# EAGLE design xadow-3-Axis Digital Accelerometer(б└400g) (EAGLE 6.4)

## Sheet 1 of 2
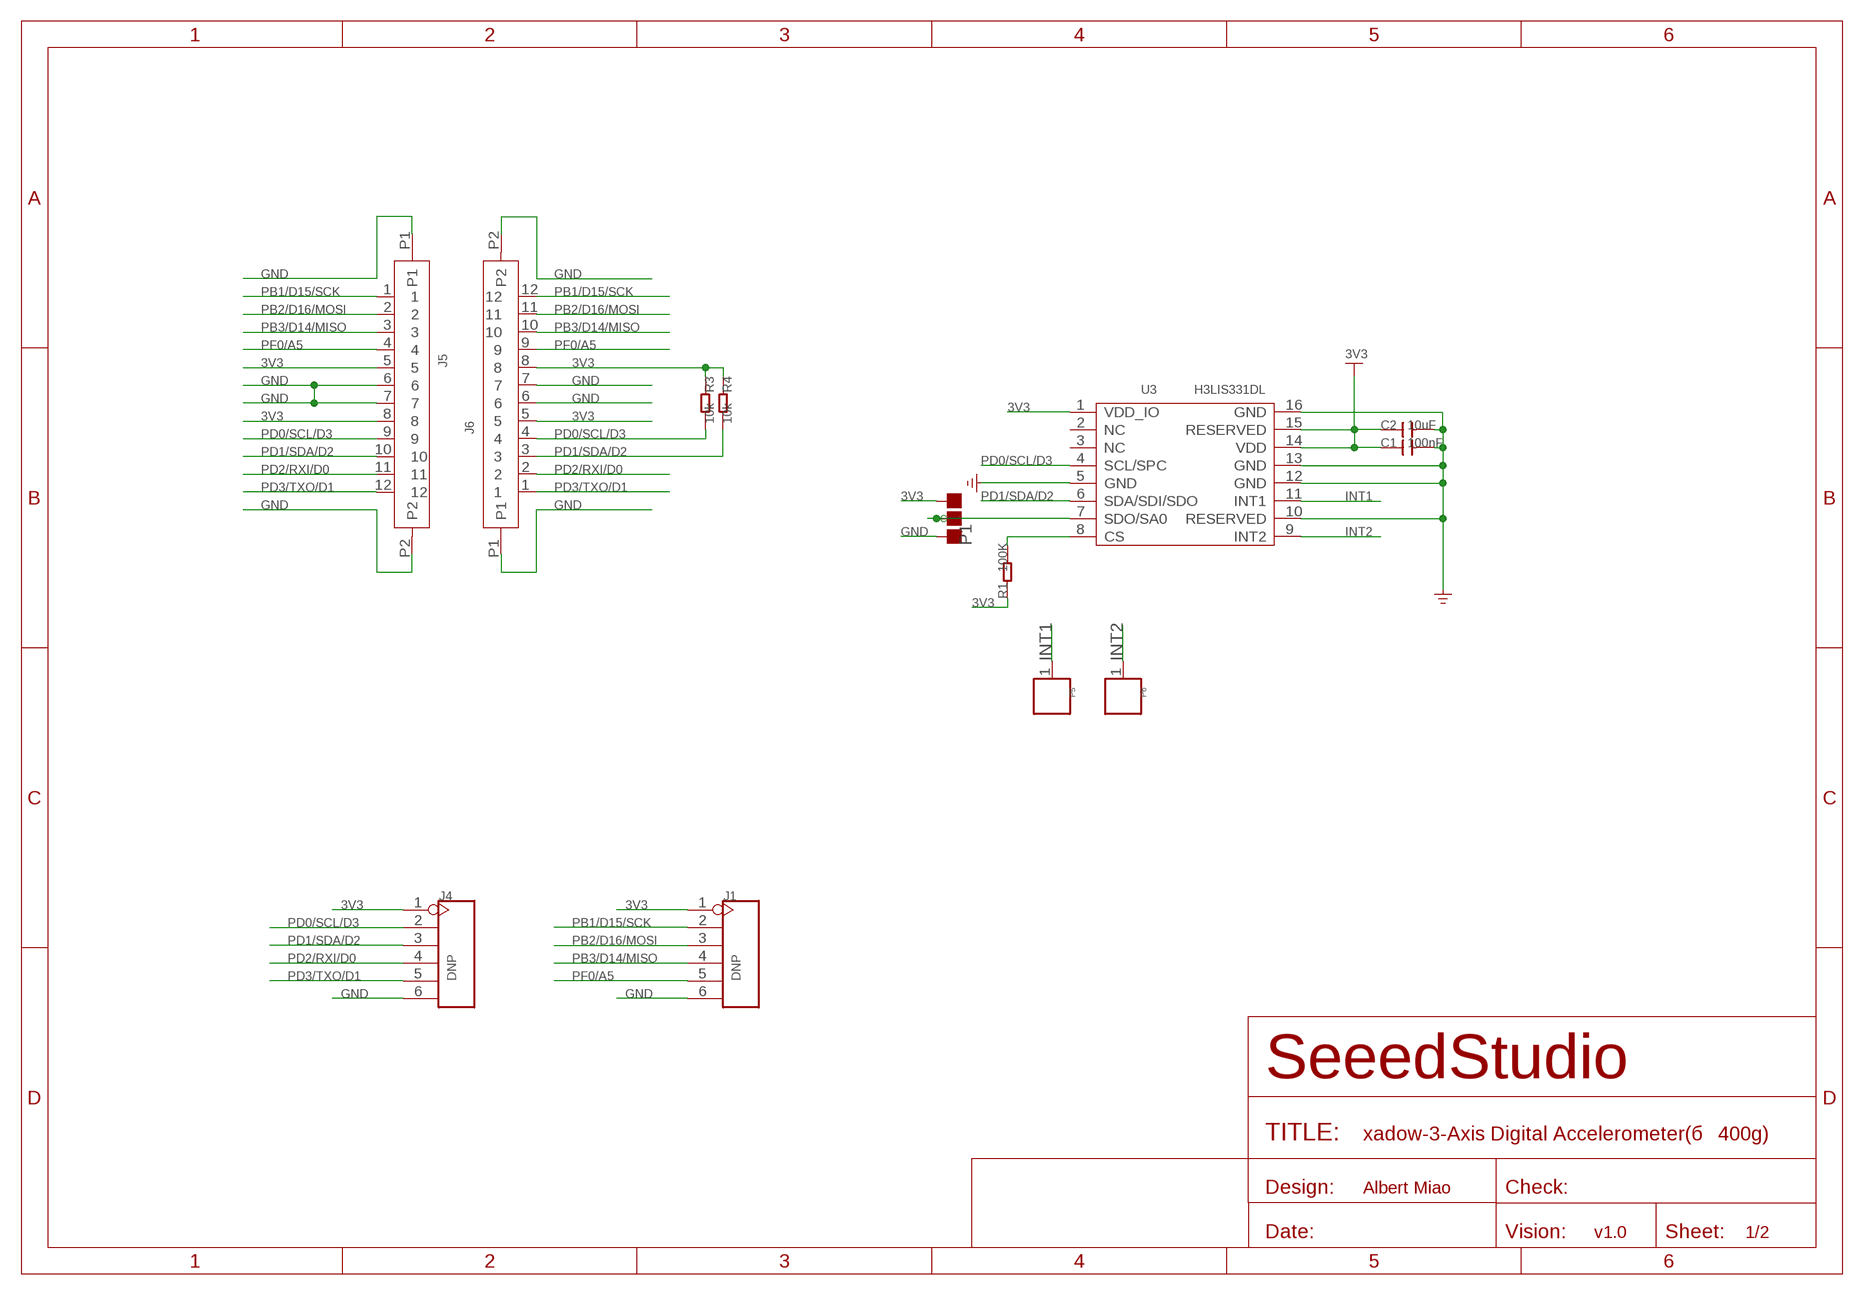
[diagram p0: schematic, sheet 1]

### Parts
C1  100nF  C-0603  [C0603]
C2  10uF  C-0805  [C0805]
J1  DNP  HEADER-6P-65/35MIL  [6P-2.54-65/35MIL]
J4  DNP  HEADER-6P-65/35MIL  [6P-2.54-65/35MIL]
J5  FPC052002-12LT-FH12-12S-0.5SH  [12P-0.5-NEW]
J6  FPC052002-12LT-FH12-12S-0.5SH  [12P-0.5-NEW]
P1  PAD-JUMPER-3P-40*40  [3P-SMD-4.1X1.5]
P5  PAD'60/30'  [1P-65/35MIL]
P6  PAD'60/30'  [1P-65/35MIL]
R1  100K  R-0603  [R0603]
R3  10k  R-0603  [R0603]
R4  10k  R-0603  [R0603]
U3  H3LIS331DL  H3LIS331DL  [TFLGA-16]

### Nets
3V3: C1.1 C2.1 J1.1 J4.1 J5.5 J5.8 J6.5 J6.8 P1.00(L) R1.1 R3.1 R4.1 U3.1(VDD_IO) U3.14(VDD) U3.15(RESERVED) ; supply symbol labelled POWER_BAR
GND: C1.2 C2.2 J1.6 J4.6 J5.6 J5.7 J5.P1 J5.P2 J6.6 J6.7 J6.P1 J6.P2 P1.11(R) U3.5(GND) U3.10(RESERVED) U3.12(GND) U3.13(GND) U3.16(GND)
INT1: P5.1 U3.11(INT1)
INT2: P6.1 U3.9(INT2)
N$1: R1.2 U3.8(CS)
N$3: P1.MM(C) U3.7(SDO/SA0)
PB1/D15/SCK: J1.2 J5.1 J6.12
PB2/D16/MOSI: J1.3 J5.2 J6.11
PB3/D14/MISO: J1.4 J5.3 J6.10
PD0/SCL/D3: J4.2 J5.9 J6.4 R3.2 U3.4(SCL/SPC)
PD1/SDA/D2: J4.3 J5.10 J6.3 R4.2 U3.6(SDA/SDI/SDO)
PD2/RXI/D0: J4.4 J5.11 J6.2
PD3/TXO/D1: J4.5 J5.12 J6.1
PF0/A5: J1.5 J5.4 J6.9
Unconnected: U3.2(NC) U3.3(NC)

### Notes on the sheet
- Albert Miao
- v1.0

## Sheet 2 of 2
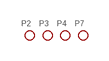
[diagram p1: schematic, sheet 2]

### Parts
P2  PAD-MARK  [ROUND-MARK-1.0]
P3  PAD-MARK  [ROUND-MARK-1.0]
P4  PAD-MARK  [ROUND-MARK-1.0]
P7  PAD-MARK  [ROUND-MARK-1.0]

## Library data of the parts
C1 C2 = Discrete:C*: Ceramic Capacitors
J1 J4 = Connector:HEADER-6P
J5 J6 = template :FPC052002-12LT
P1 = Discrete:PAD-JUMPER-3P; PARTNO: DNP
P2-P4 P7 = Discrete:PAD-MARK; PARTNO: DNP
P5 P6 = Discrete:PAD
R1 R3 R4 = Discrete:R*
U3 = template :H3LIS331DL: MEMS motion sensor with digital output, low power, high-g, 3-axis accelerometer

## Net classes
0 default: width 0.152 mm, drill 0.305 mm, clearance 0.152 mm
1 GND: width 0.152 mm, drill 0.305 mm, clearance 0.152 mm to class 0, clearance 0.152 mm

## Board
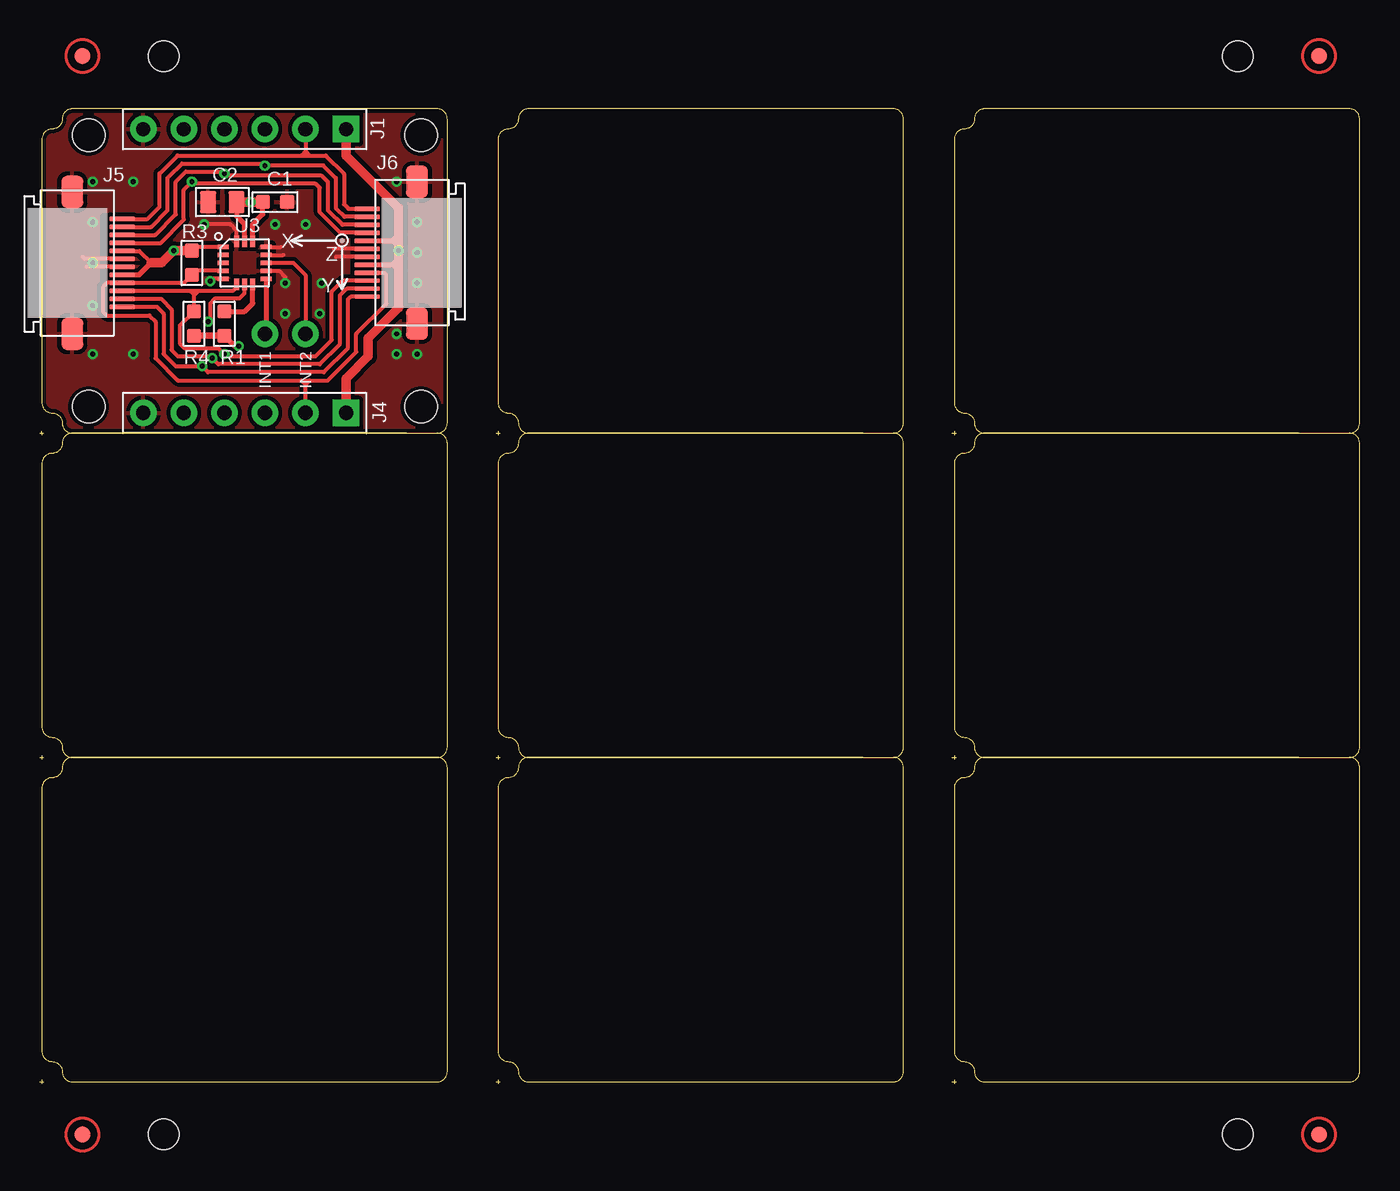
[diagram p2: board, top side]
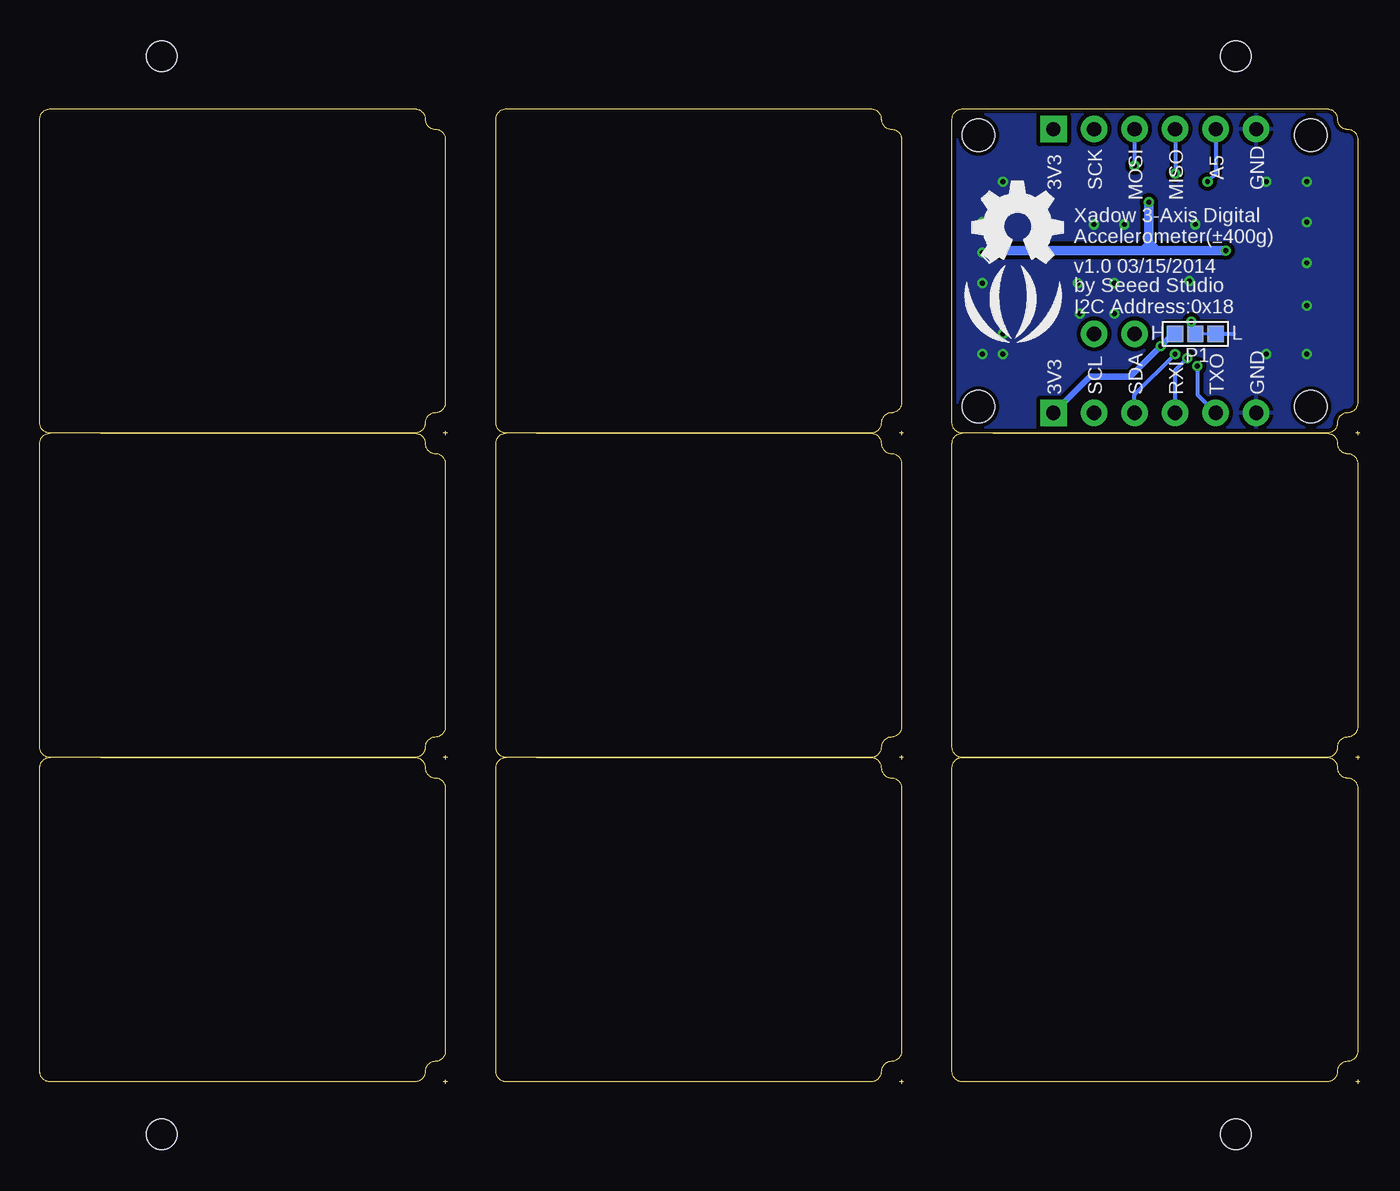
[diagram p3: board, bottom side, seen from below]

Size 82.68 x 61.09 mm. Coordinates in mm from the lower left corner, seen from the top.
Outline: 25.53,60.45 arc90 24.89,61.09
Outline: 2.03,61.09 arc90 1.4,60.45
Outline: 1.4,60.45 arc-90 0.76,59.82
Outline: 0.76,59.82 arc90 0.13,59.18
Outline: 0.13,42.67 arc90 0.76,42.04
Outline: 0.76,42.04 arc-90 1.4,41.4
Outline: 1.4,41.4 arc90 2.03,40.77
Outline: 24.89,40.77 arc90 25.53,41.4
Outline: 25.53,60.45 arc90 24.89,61.09
Outline: 24.89,61.09 2.03,61.09
Outline: 2.03,61.09 arc90 1.4,60.45
Outline: 1.4,60.45 arc-90 0.76,59.82
Outline: 0.76,59.82 arc90 0.13,59.18
Outline: 0.13,42.67 arc90 0.76,42.04
Outline: 0.76,42.04 arc-90 1.4,41.4
Outline: 1.4,41.4 arc90 2.03,40.77
Outline: 2.03,40.77 22.99,40.77
Outline: 22.99,40.77 24.89,40.77
Outline: 24.89,40.77 arc90 25.53,41.4
Outline: 0.13,40.77 0.25,40.77
Outline: 0.13,40.77 0.13,40.89
Outline: 25.53,41.4 25.53,60.45
Outline: 25.53,60.45 arc90 24.89,61.09
Outline: 2.03,61.09 arc90 1.4,60.45
Outline: 1.4,60.45 arc-90 0.76,59.82
Outline: 0.76,59.82 arc90 0.13,59.18
Outline: 0.13,59.18 0.13,42.67
Outline: 0.13,42.67 arc90 0.76,42.04
Outline: 0.76,42.04 arc-90 1.4,41.4
Outline: 1.4,41.4 1.4,41.4
Outline: 1.4,41.4 arc90 2.03,40.77
Outline: 2.03,40.77 24.89,40.77
Outline: 24.89,40.77 arc90 25.53,41.4
Outline: 0,40.77 0.13,40.77
Outline: 0.13,40.77 0.13,40.64
Outline: 82.04,20.45 arc-90 82.68,19.81 82.68,0.76 arc-90 82.04,0.13 78.87,0.13 59.18,0.13 arc-90 58.55,0.76
Outline: 78.87,20.45 59.18,20.45
Outline: 59.18,20.45 arc90 58.55,19.81 arc-90 57.91,19.18 arc90 57.28,18.54 57.28,2.03 arc90 57.91,1.4 arc-90 58.55,0.76
Outline: 58.55,0.76 58.55,0.76
Outline: 57.15,0.13 57.4,0.13
Outline: 57.28,0.25 57.28,0
Outline: 24.89,20.45 arc-90 25.53,19.81 25.53,0.76 arc-90 24.89,0.13 2.03,0.13 arc-90 1.4,0.76
Outline: 24.89,20.45 2.03,20.45
Outline: 2.03,20.45 arc90 1.4,19.81 arc-90 0.76,19.18 arc90 0.13,18.54 0.13,2.03 arc90 0.76,1.4 arc-90 1.4,0.76
Outline: 1.4,0.76 1.4,0.76
Outline: 0,0.13 0.25,0.13
Outline: 0.13,0.25 0.13,0
Outline: 53.47,20.45 arc-90 54.1,19.81 54.1,0.76 arc-90 53.47,0.13 51.56,0.13 30.61,0.13 arc-90 29.97,0.76
Outline: 51.56,20.45 30.61,20.45
Outline: 30.61,20.45 arc90 29.97,19.81 arc-90 29.34,19.18 arc90 28.7,18.54 28.7,2.03 arc90 29.34,1.4 arc-90 29.97,0.76
Outline: 29.97,0.76 29.97,0.76
Outline: 28.57,0.13 28.83,0.13
Outline: 28.7,0.25 28.7,0
Outline: 58.55,41.4 arc90 57.91,42.04 arc-90 57.28,42.67 57.28,59.18 arc-90 57.91,59.82 arc90 58.55,60.45 arc-90 59.18,61.09 82.04,61.09 arc-90 82.68,60.45 82.68,41.4 arc-90 82.04,40.77
Outline: 58.55,41.4 58.55,41.4
Outline: 58.55,41.4 arc90 59.18,40.77
Outline: 59.18,40.77 78.87,40.77
Outline: 78.87,40.77 82.04,40.77
Outline: 57.15,40.77 57.4,40.77
Outline: 57.28,40.89 57.28,40.64
Outline: 29.97,41.4 arc90 29.34,42.04 arc-90 28.7,42.67 28.7,59.18 arc-90 29.34,59.82 arc90 29.97,60.45 arc-90 30.61,61.09 53.47,61.09 arc-90 54.1,60.45 54.1,41.4 arc-90 53.47,40.77
Outline: 29.97,41.4 29.97,41.4
Outline: 29.97,41.4 arc90 30.61,40.77
Outline: 30.61,40.77 51.56,40.77
Outline: 51.56,40.77 53.47,40.77
Outline: 28.57,40.77 28.83,40.77
Outline: 28.7,40.89 28.7,40.64
Outline: 82.04,40.77 arc-90 82.68,40.13 82.68,21.08 arc-90 82.04,20.45
Outline: 78.87,40.77 59.18,40.77
Outline: 59.18,40.77 arc90 58.55,40.13 arc-90 57.91,39.5 arc90 57.28,38.86 57.28,22.35 arc90 57.91,21.72 arc-90 58.55,21.08
Outline: 58.55,21.08 58.55,21.08
Outline: 58.55,21.08 arc90 59.18,20.45
Outline: 59.18,20.45 78.87,20.45
Outline: 78.87,20.45 82.04,20.45
Outline: 57.15,20.45 57.4,20.45
Outline: 57.28,20.57 57.28,20.32
Outline: 24.89,40.77 arc-90 25.53,40.13 25.53,21.08 arc-90 24.89,20.45
Outline: 22.99,40.77 2.03,40.77
Outline: 2.03,40.77 arc90 1.4,40.13 arc-90 0.76,39.5 arc90 0.13,38.86 0.13,22.35 arc90 0.76,21.72 arc-90 1.4,21.08
Outline: 1.4,21.08 1.4,21.08
Outline: 1.4,21.08 arc90 2.03,20.45
Outline: 2.03,20.45 24.89,20.45
Outline: 0,20.45 0.25,20.45
Outline: 0.13,20.57 0.13,20.32
Outline: 53.47,40.77 arc-90 54.1,40.13 54.1,21.08 arc-90 53.47,20.45
Outline: 51.56,40.77 30.61,40.77
Outline: 30.61,40.77 arc90 29.97,40.13 arc-90 29.34,39.5 arc90 28.7,38.86 28.7,22.35 arc90 29.34,21.72 arc-90 29.97,21.08
Outline: 29.97,21.08 29.97,21.08
Outline: 29.97,21.08 arc90 30.61,20.45
Outline: 30.61,20.45 51.56,20.45
Outline: 51.56,20.45 53.47,20.45
Outline: 28.57,20.45 28.83,20.45
Outline: 28.7,20.57 28.7,20.32
Copper layers (1*16): Top 0.035mm / dielectric 1.5mm / Bottom 0.035mm
Design rules "SeeedStudio_rule_no_angle_090911 *": minimum track width 6mil, minimum drill 12mil, track to track 6mil, track to pad 6mil, pad to pad 6mil, via to via 6mil, smd to smd 0mil, copper to edge 10mil, drill to drill 10mil, minimum pad ring 10mil, minimum via ring 6mil, stop-mask expansion 2mil, vias tented up to drill 100mil, thermal gap 10mil
Holes 2.03 mm at 3.05,42.42 3.05,59.44 23.88,59.44 23.88,42.42
Holes 1.91 mm at 75.06,64.39 7.75,64.39 7.75,-3.17 75.06,-3.17
tRestrict: area 4.6,50.9 to 5.2,51; area 20.4,50.9 to 21,51; area 11.2,50 to 12.1,50.2; area 14,52.1 to 14.5,52.2; 21 lines
bRestrict: 21 lines

### Footprints (pad centres in the part's own frame; a part is rotated, then mirrored left to right if it is on the bottom)
C0603 = smd 0.889 x 0.889: 1 -0.762,0; 2 0.762,0
C0805 = smd 1.016 x 1.397: 1 -0.889,0; 2 0.889,0
6P-2.54-65/35MIL = drill 0.889 pad 1.651 square: 1 0,6.35 | drill 0.889 pad 1.651: 2 0,3.81; 3 0,1.27; 4 0,-1.27; 5 0,-3.81; 6 0,-6.35
12P-0.5-NEW = smd 0.3 x 1.6: 1 -2.75,3.127; 2 -2.25,3.127; 3 -1.75,3.127; 4 -1.25,3.127; 5 -0.75,3.127; 6 -0.25,3.127; 7 0.25,3.127; 8 0.75,3.127; 9 1.25,3.127; 10 1.75,3.127; 11 2.25,3.127; 12 2.75,3.127 | smd 2.032 x 1.397: P1 -4.445,0; P2 4.445,0
3P-SMD-4.1X1.5 = smd 1.016 x 1.016: 00 -1.27,0; 11 1.27,0; MM 0,0
ROUND-MARK-1.0 = smd 1.016 x 1.016: P$1 0,0
1P-65/35MIL = drill 0.889 pad 1.651: 1 0,0
R0603 = smd 0.889 x 0.889: 1 -0.762,0; 2 0.762,0
TFLGA-16 = smd 0.7 x 0.3: 1 -1.35,1; 2 -1.35,0.5; 3 -1.35,0; 4 -1.35,-0.5; 5 -1.35,-1; 9 1.35,-1; 10 1.35,-0.5; 11 1.35,0; 12 1.35,0.5; 13 1.35,1 | smd 0.3 x 0.7: 6 -0.5,-1.35; 7 0,-1.35; 8 0.5,-1.35; 14 0.5,1.35; 15 0,1.35; 16 -0.5,1.35

### Placement (x,y rotation side)
C1  14.73,55.25 0 top
C2  11.43,55.25 180 top
J1  12.83,59.82 270 top
J4  12.83,42.04 270 top
J5  2.03,51.44 270 top
J6  23.62,52.07 90 top
P1  10.29,46.99 0 bottom
P2  2.67,-3.17 0 top  (outside the outline)
P3  80.14,-3.17 0 top  (outside the outline)
P4  80.14,64.39 0 top  (outside the outline)
P5  16.64,46.99 0 top
P6  14.1,46.99 0 top
P7  2.67,64.39 0 top  (outside the outline)
R1  11.56,47.62 90 top
R3  9.53,51.44 270 top
R4  9.65,47.62 90 top
U3  12.83,51.44 0 top
U$2  [LOGO_SILK]  21.72,48.13 0 bottom
U$3  [OSHW_FILLX200_NOTEXT]  24.26,51.44 0 bottom

### Tracks (layer width: path | path; a pad name or v marks a point on that pad's centre or on a via)
3V3  (via drill 0.3 pad 0.64)
  Top 0.254: J5.5 6.24,52.19 6.99,51.44 | U3.1 9.76,52.44 R3.1
  Top 0.305: U3.15 12.83,53.85 12.32,54.36 C2.1 | U3.14 13.33,53.84 13.97,54.48 C1.1 | J5.8 6.24,50.69 6.99,51.44 | R1.1 12.19,46.23 v12.45,46.23 | J6.5 22.09,51.32 | 22.09,51.32 22.11,51.32 22.48,51.69 | J6.8 22.09,52.82 | 22.09,52.82 22.1,52.82 | 22.1,52.82 22.1,52.83 | 22.09,52.82 22.48,53.21 | 22.1,52.82 22.11,52.82 22.48,52.45 | 22.09,51.32 22.48,50.93
  Top 0.406: R4.1 R1.1
  Top 0.61: C1.1 v13.21,55.25 C2.1 | 6.99,51.44 7.62,51.44 v8.38,52.2 R3.1 | J4.1 19.18,44.2 20.57,45.59 20.57,46.74 22.48,48.64 22.48,50.93 22.48,51.69 v22.48,52.2 22.48,52.45 22.48,53.21 22.48,54.86 19.18,58.17 J1.1
  Bottom 0.406: J4.1 16.89,44.32 14.35,44.32 v12.45,46.23 11.68,46.99 P1.00
  Bottom 0.61: v8.38,52.2 12.7,52.2 | 12.7,52.2 13.59,52.2 | 13.59,52.2 v22.48,52.2 | v13.21,55.25 13.21,52.71 | 13.21,52.71 12.7,52.2 | 13.21,52.71 13.21,52.58 13.59,52.2
GND  (via drill 0.3 pad 0.64)
  Top 0.254: U3.12 15.23,51.94 15.24,51.94 | J6.7 18.42,52.32 | J6.6 18.55,51.82 | J5.6 2.8,51.69 2.67,51.82 | J5.7 2.93,51.19 2.92,51.18 | U3.10 14.98,50.94 15.37,50.55 v15.37,50.16 | U3.16 12.33,53.46 11.94,53.85 v10.29,53.85 | U3.5 10.81,50.44 v10.67,50.29 | U3.13 15.1,52.44 15.11,52.45
  Bottom 0.254: P1.11 7.87,46.99
  other vias: 14.73,53.85 16.64,53.85 17.65,50.16 15.37,48.26 17.53,48.26 3.3,51.44 3.3,53.98 3.3,56.52 3.3,48.77 3.3,45.72 5.84,45.72 5.84,56.52 22.35,56.52 23.62,53.98 23.62,52.07 23.62,50.16 23.62,45.72 22.35,46.99 22.35,45.72
  pour Top (isolate 0.254): 0.13,40.77 25.53,40.77 25.53,61.09 0.13,61.09
  pour Bottom (isolate 0.254): 0.13,40.77 25.53,40.77 25.53,61.09 0.13,61.09
INT1
  Top 0.254: U3.11 15.88,51.44 16.64,50.67 P5.1
INT2
  Top 0.305: U3.9 14.18,47.07 P6.1
N$1
  Top 0.305: R1.2 12.83,48.39 13.34,48.9 U3.8
N$3  (via drill 0.3 pad 0.64)
  Top 0.254: U3.7 12.83,49.53 12.51,49.21 10.99,49.21 10.67,48.9 10.67,47.88 v10.54,47.75
  Bottom 0.203: 10.41,46.99 9.4,46.99
  Bottom 0.305: P1.MM 10.41,46.99 10.54,46.99 v10.54,47.75
PB1/D15/SCK
  Top 0.254: J5.1 6.73,54.19 7.49,54.95 7.49,57.03 8.63,58.17 16.38,58.17 | 16.38,58.17 16.89,58.17 | 16.89,58.17 17.91,58.17 19.05,57.02 19.05,55.11 19.34,54.82 J6.12 | J1.2 16.64,58.42 | 16.64,58.42 16.38,58.17 | 16.64,58.42 16.89,58.17
PB2/D16/MOSI  (via drill 0.3 pad 0.64)
  Top 0.254: J6.11 19.09,54.32 18.54,54.86 18.54,56.74 17.75,57.53 v14.1,57.53 13.97,57.66 8.9,57.66 8,56.76 8,54.73 6.96,53.69 J5.2
  Bottom 0.254: J1.3 v14.1,57.53
PB3/D14/MISO  (via drill 0.3 pad 0.64)
  Top 0.254: J5.3 7.22,53.19 8.51,54.47 8.51,56.52 9.14,57.15 11.43,57.15 v11.56,57.02 11.68,56.9 17.65,56.9 18.03,56.52 18.03,54.74 18.95,53.82 J6.10
  Bottom 0.254: J1.4 v11.56,57.02
PD0/SCL/D3
  Top 0.254: U3.4 9.79,50.94 R3.2 9.04,50.19 J5.9 4.21,50.19 3.94,49.91 3.94,48.39 4.19,48.13 6.86,48.13 7.24,47.75 7.24,45.47 8.64,44.07 16.38,44.07 | 16.38,44.07 16.89,44.07 | 16.89,44.07 18.03,44.07 19.81,45.85 19.81,46.99 21.72,48.9 21.72,50.67 21.57,50.82 J6.4 | J4.2 16.64,43.82 | 16.64,43.82 16.38,44.07 | 16.64,43.82 16.89,44.07
PD1/SDA/D2  (via drill 0.3 pad 0.64)
  Top 0.254: J5.10 9.4,49.69 | 9.4,49.69 12.09,49.69 12.32,49.91 U3.6 | 9.65,49.4 R4.2 8.76,47.5 8.76,46.39 9.05,46.1 11.18,46.1 v11.56,45.72 11.68,45.59 17.27,45.59 18.29,46.61 18.29,49.63 18.97,50.32 J6.3 | 9.65,49.4 9.65,49.43 | 9.65,49.43 9.4,49.69 | 9.65,49.43 9.65,49.47 | 9.65,49.4 9.91,49.66
  Bottom 0.254: J4.3 14.1,43.18 v11.56,45.72
PD2/RXI/D0  (via drill 0.3 pad 0.64)
  Top 0.254: J5.11 7.58,49.19 8.25,48.51 8.25,45.97 8.64,45.59 10.67,45.59 v10.79,45.47 11.18,45.09 17.53,45.09 18.8,46.36 18.8,49.4 19.21,49.82 J6.2
  Bottom 0.254: J4.4 11.56,44.7 v10.79,45.47
PD3/TXO/D1  (via drill 0.3 pad 0.64)
  Top 0.254: J5.12 7.32,48.69 7.75,48.26 7.75,45.72 8.51,44.96 v10.16,44.96 10.54,44.58 17.78,44.58 19.3,46.1 19.3,49.15 19.48,49.32 J6.1
  Bottom 0.254: v10.16,44.96 10.16,43.18 J4.5
PF0/A5  (via drill 0.3 pad 0.64)
  Top 0.254: J5.4 7.56,52.69 9.02,54.15 9.02,56.01 v9.53,56.52 9.65,56.39 17.27,56.39 17.53,56.13 17.53,54.61 18.82,53.32 J6.9
  Bottom 0.254: J1.5 9.02,57.02 v9.53,56.52

### Text on the board
tPlace: INT1 | INT2
bPlace: GND | A5 | SCK | 3V3 | MISO | MOSI | Xadow 3-Axis Digital / Accelerometer(±400g) | v1.0 03/15/2014 | by Seeed Studio | I2C Address:0x18 | L | H | GND | TXO | RXI | SDA | SCL | 3V3
tNames: X | Z | Y
tEnhance: Top Enhance 0.25~0.28mm | Top Enhance 0.25~0.28mm
bEnhance: Bottom Enhance | Bottom Enhance
bEnHoles: Holes on Bottom Enhance | Holes on Bottom Enhance | All Holes are 70mil diameter | All Holes are 70mil diameter